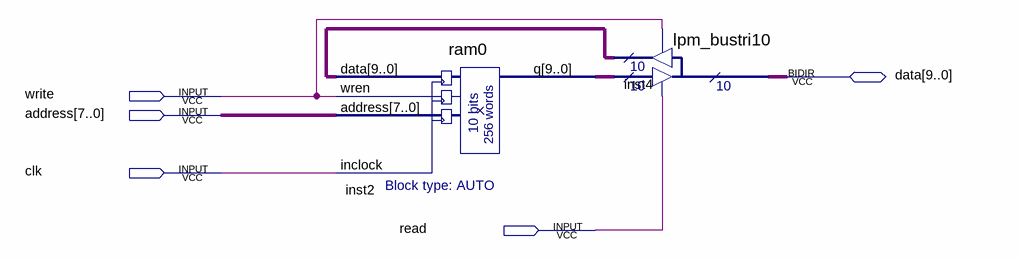
[diagram p0: schematic sheet]
// Quartus schematic ram.bdf as structural Verilog: 2 symbols, 5 pins
module ram (
  input  write,
  input  [7:0] address,
  input  clk,
  input  read,
  inout  [9:0] data
);

  wire [9:0] inst2_q, inst4_result;

  ram0 inst2 (.data(inst4_result), .wren(write), .address(address), .inclock(clk), .q(inst2_q));
  lpm_bustri10 inst4 (.enabledt(read), .data(inst2_q), .enabletr(write), .result(inst4_result), .tridata(data));
endmodule
